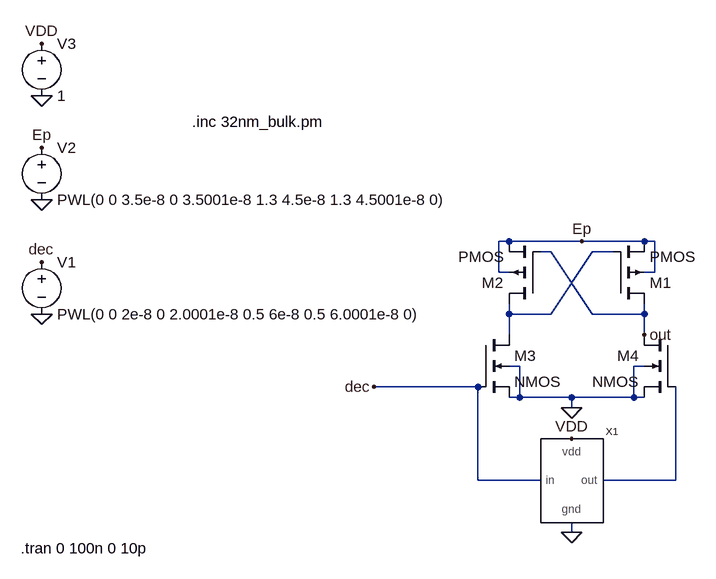
[diagram p0: schematic decoder_amplifaer.asc]
decoder_amplifaer.asc, the LTspice schematic file:
Version 4
SHEET 1 880 680
WIRE 64 32 48 32
WIRE 176 32 64 32
WIRE 272 32 176 32
WIRE 288 32 272 32
WIRE 128 48 112 48
WIRE 224 48 192 48
WIRE 48 80 48 32
WIRE 64 80 48 80
WIRE 288 80 288 32
WIRE 288 80 272 80
WIRE 64 144 64 128
WIRE 128 144 192 48
WIRE 128 144 64 144
WIRE 192 144 128 48
WIRE 272 144 272 128
WIRE 272 144 192 144
WIRE 64 176 64 144
WIRE 272 176 272 144
WIRE 80 224 64 224
WIRE 272 224 256 224
WIRE 16 256 -144 256
WIRE 80 272 80 224
WIRE 80 272 64 272
WIRE 160 272 80 272
WIRE 256 272 256 224
WIRE 256 272 160 272
WIRE 272 272 256 272
WIRE 160 288 160 272
WIRE 16 400 16 256
WIRE 112 400 16 400
WIRE 320 400 320 256
WIRE 320 400 208 400
WIRE 160 480 160 464
FLAG 160 288 0
FLAG 160 480 0
FLAG 176 32 Ep
FLAG 160 336 VDD
FLAG 272 176 out
FLAG -656 144 0
FLAG -656 -32 0
FLAG -656 -112 Ep
FLAG -656 64 dec
FLAG -144 256 dec
FLAG -656 -192 0
FLAG -656 -272 VDD
SYMBOL invert 160 400 R0
SYMATTR InstName X1
SYMBOL voltage -656 48 R0
WINDOW 123 0 0 Left 0
WINDOW 39 0 0 Left 0
SYMATTR InstName V1
SYMATTR Value PWL(0 0 2e-8 0 2.0001e-8 0.5 6e-8 0.5 6.0001e-8 0)
SYMBOL voltage -656 -128 R0
WINDOW 123 0 0 Left 0
WINDOW 39 0 0 Left 0
SYMATTR InstName V2
SYMATTR Value PWL(0 0 3.5e-8 0 3.5001e-8 1.3 4.5e-8 1.3 4.5001e-8 0)
SYMBOL pmos4 224 128 M180
SYMATTR InstName M1
SYMATTR Value2 l=32e-9 w=640e-9 ad=51200e-18 as=51200e-18 pd=960e-9 ps=960e-9
SYMBOL pmos4 112 128 R180
SYMATTR InstName M2
SYMATTR Value2 l=32e-9 w=640e-9 ad=51200e-18 as=51200e-18 pd=960e-9 ps=960e-9
SYMBOL nmos4 16 176 R0
SYMATTR InstName M3
SYMATTR Value2 l=32e-9 w=320e-9 ad=51200e-18 as=51200e-18 pd=960e-9 ps=960e-9
SYMBOL nmos4 320 176 M0
SYMATTR InstName M4
SYMATTR Value2 l=32e-9 w=320e-9 ad=51200e-18 as=51200e-18 pd=960e-9 ps=960e-9
SYMBOL voltage -656 -288 R0
WINDOW 123 0 0 Left 0
WINDOW 39 0 0 Left 0
SYMATTR InstName V3
SYMATTR Value 1
TEXT -424 -152 Left 2 !.inc 32nm_bulk.pm
TEXT -688 504 Left 2 !.tran 0 100n 0 10p

The netlist it stands for:
* decoder_amplifaer.asc
XX1 dec VDD 0 N002 invert  ; pins in vdd gnd out
V1 dec 0 PWL(0 0 2e-8 0 2.0001e-8 0.5 6e-8 0.5 6.0001e-8 0)
V2 Ep 0 PWL(0 0 3.5e-8 0 3.5001e-8 1.3 4.5e-8 1.3 4.5001e-8 0)
M1 out N001 Ep Ep PMOS l=32e-9 w=640e-9 ad=51200e-18 as=51200e-18 pd=960e-9 ps=960e-9
M2 N001 out Ep Ep PMOS l=32e-9 w=640e-9 ad=51200e-18 as=51200e-18 pd=960e-9 ps=960e-9
M3 N001 dec 0 0 NMOS l=32e-9 w=320e-9 ad=51200e-18 as=51200e-18 pd=960e-9 ps=960e-9
M4 out N002 0 0 NMOS l=32e-9 w=320e-9 ad=51200e-18 as=51200e-18 pd=960e-9 ps=960e-9
V3 VDD 0 1
.model NMOS NMOS
.model PMOS PMOS
.lib standard.mos
.inc 32nm_bulk.pm
.tran 0 100n 0 10p
.backanno
.end

* Results of the author's LTspice run, read from the files saved beside the schematic
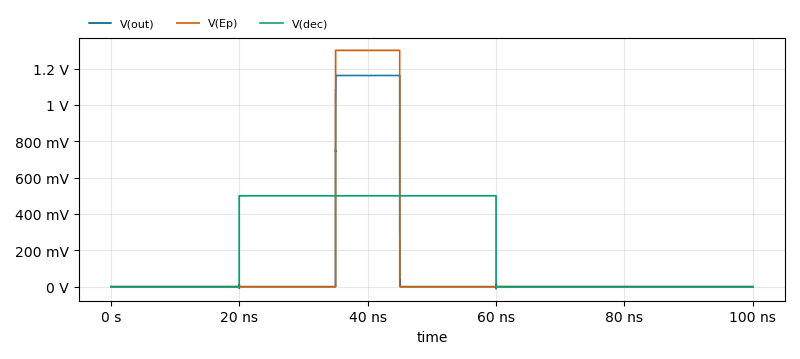
[diagram p1: Transient Analysis of decoder_amplifaer.asc, plotted from the saved traces]
* Transient Analysis, 1 run:
*   V(out): min -11.58 mV, max 1.162 V, average 116.2 mV, rms 367.1 mV, last 2.117 µV
*   V(Ep): min 0 V, max 1.3 V, average 130 mV, rms 411.1 mV, last 0 V
*   V(dec): min 0 V, max 500 mV, average 200 mV, rms 316.2 mV, last 0 V